# EAGLE design fan_control_module.0.9 (EAGLE 6.4)
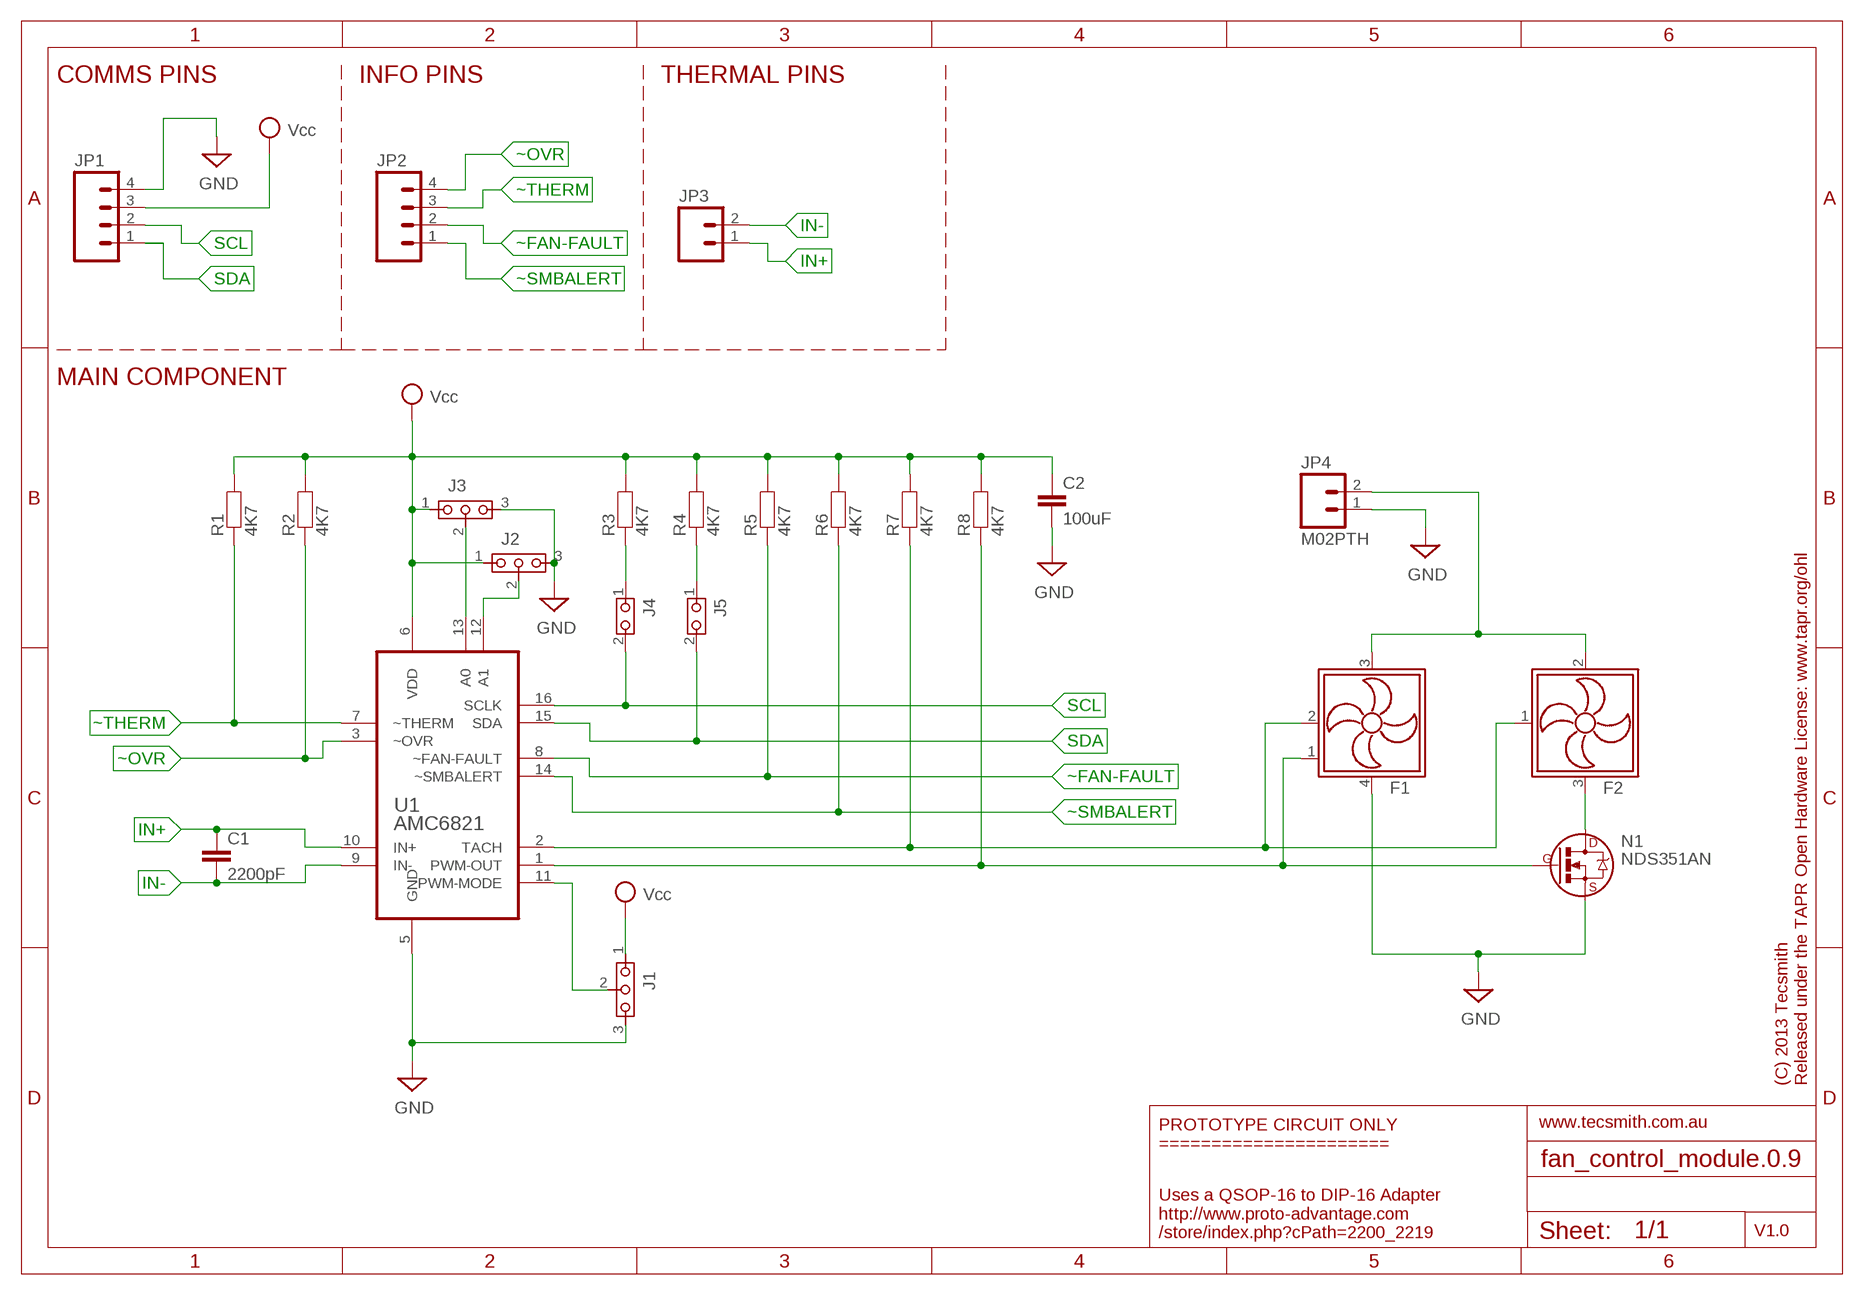
[diagram p0: schematic, sheet 1]

## Parts
C1  2200pF  CAP0603  [0603]
C2  100uF  CAP0603  [0603]
F1  FAN_4-WIREINTEL  [47053-1000]
F2  FAN_3-WIRE  [22-23-2031]
J1  SJ3SMD  [SJ2]
J2  SJ3SMD  [SJ2]
J3  SJ3SMD  [SJ2]
J4  SJSMD  [SJ]
J5  SJSMD  [SJ]
JP1  M04PTH  [1X04]
JP2  M04PTH  [1X04]
JP3  M02PTH  [1X02]
JP4  M02PTH  [1X02]
N1  NDS351AN  NMOSFETGSD  [SOT23]
R1  4K7  RESISTOR0603  [0603]
R2  4K7  RESISTOR0603  [0603]
R3  4K7  RESISTOR0603  [0603]
R4  4K7  RESISTOR0603  [0603]
R5  4K7  RESISTOR0603  [0603]
R6  4K7  RESISTOR0603  [0603]
R7  4K7  RESISTOR0603  [0603]
R8  4K7  RESISTOR0603  [0603]
U1  AMC6821  AMC6821SDBQQSOP  [QSOP-16N]

## Nets
3WIRE-GND: F2.3(GND) N1.3(D)
A0: J3.2 U1.13(A0)
A1: J2.2 U1.12(A1)
GND: C2.2 F1.4(GND) J1.3 J2.3 J3.3 JP1.4 JP4.1 N1.2(S) U1.5(GND)
IN+: C1.1 JP3.1 U1.10(IN+)
IN-: C1.2 JP3.2 U1.9(IN-)
PWM: F1.1(PWM) N1.1(G) R8.1 U1.1(PWM-OUT)
PWM-MODE: J1.2 U1.11(PWM-MODE)
SCL: J4.2 JP1.2 U1.16(SCLK)
SCL-X: J4.1 R3.1
SDA: J5.2 JP1.1 U1.15(SDA)
SDA-X: J5.1 R4.1
TACH: F1.2(SENSE) F2.1(SENSE) R7.1 U1.2(TACH)
VCC: C2.1 J1.1 J2.1 J3.1 JP1.3 R1.2 R2.2 R3.2 R4.2 R5.2 R6.2 R7.2 R8.2 U1.6(VDD) ; supply symbol labelled Vcc
VFAN: F1.3(PWR) F2.2(PWR) JP4.2
~FAN-FAULT: JP2.2 R5.1 U1.8(~FAN-FAULT)
~OVR: JP2.4 R2.1 U1.3(~OVR)
~SMBALERT: JP2.1 R6.1 U1.14(~SMBALERT)
~THERM: JP2.3 R1.1 U1.7(~THERM)

## Notes on the sheet
- COMMS PINS | INFO PINS | THERMAL PINS
- MAIN COMPONENT
- (C) 2013 Tecsmith | Released under the TAPR Open Hardware License: www.tapr.org/ohl
- www.tecsmith.com.au
- PROTOTYPE CIRCUIT ONLY
  ======================
- V1.0
- Uses a QSOP-16 to DIP-16 Adapter
  http://www.proto-advantage.com
  /store/index.php?cPath=2200_2219

## Library data of the parts
C1 C2 = arduino:CAP: Capacitor Standard 0603 ceramic capacitor, and 0.1" leaded capacitor.
F1 = fans:FAN_4-WIRE: INTEL SPEC HEADER Source: http://www.molex.com/pdm_docs/sd/026604100_sd.pdf
F2 = fans:FAN_3-WIRE
J1-J3 = arduino:SJ3
J4 J5 = arduino:SJ: SMD solder JUMPER
JP1 JP2 = arduino:M04: Header 4 Standard 4-pin 0.1" header. Use with straight break away headers (SKU : PRT-00116), right angle break away headers (PRT-00553), swiss pins (PRT-00743), machine pins (PRT-00117), and female headers (PRT-00115). Molex polarized connector foot print use with SKU : PRT-08231 with associated crimp pins and housings.
JP3 JP4 = arduino:M02: Header 2
N1 = arduino:NMOSFET: N-Channel MOSFET
R1-R8 = arduino:RESISTOR: Resistor Basic schematic elements and footprints for 0603, 1206, and PTH 1/10th watt (small) resistors.
U1 = ti-fans:AMC6821SDBQ: Intelligent Temperature Monitor and PWM Fan Controller; MPN: AMC6821SDBQ; OC_FARNELL: 1754744; OC_NEWARK: 52M3024; PACKAGE: QSOP-16; SUPPLIER: TEXAS INSTRUMENTS

## Board
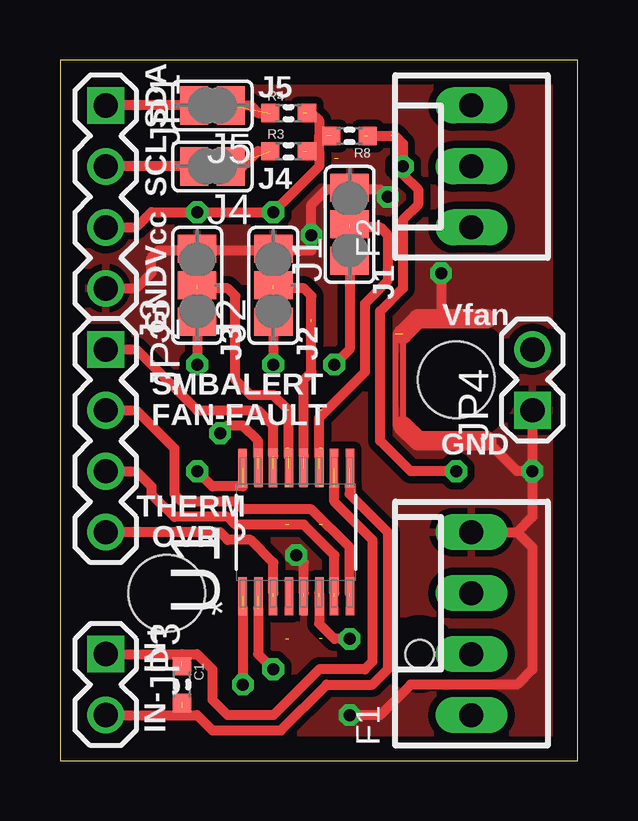
[diagram p1: board, top side]
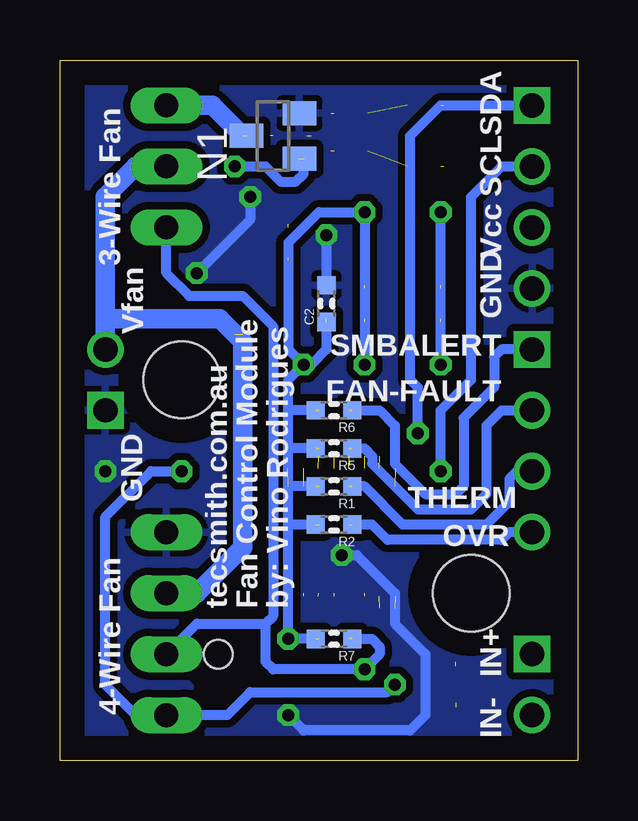
[diagram p2: board, bottom side, seen from below]

Size 21.58 x 29.2 mm. Coordinates in mm from the lower left corner, seen from the top.
Outline: 0,0 21.58,0 21.58,29.2 0,29.2 0,0
Copper layers (1*16): Top 0.035mm / dielectric 1.5mm / Bottom 0.035mm
Design rules "default": minimum track width 10mil, minimum drill 24mil, track to track 8mil, track to pad 8mil, pad to pad 8mil, via to via 8mil, smd to smd 8mil, copper to edge 40mil, drill to drill 8mil, minimum pad ring 10mil, minimum via ring 8mil, stop-mask expansion 4mil, vias tented up to drill 0mil, thermal gap 10mil
Holes 3.2 mm at 16.51,15.88 4.45,6.99

### Footprints (pad centres in the part's own frame; a part is rotated, then mirrored left to right if it is on the bottom)
0603 = smd 0.762 x 0.762: 1 -0.762,0; 2 0.762,0
47053-1000 = drill 1 long: 1 -3.81,0; 2 -1.27,0; 3 1.27,0; 4 3.81,0 | hole 1.2: -1.27,2.159
22-23-2031 = drill 1 long: 1 -2.54,0; 2 0,0; 3 2.54,0
SJ2 = smd 1.168 x 1.6: 1 -1.397,0; 2 0.127,0; 3 1.651,0
SJ = smd 1.168 x 1.6: 1 -0.762,0; 2 0.762,0
1X04 = drill 1.016 square: 1 0,0 | drill 1.016: 2 2.54,0; 3 5.08,0; 4 7.62,0
1X02 = drill 1.016 square: 1 0,0 | drill 1.016: 2 2.54,0
SOT23 = smd 1 x 1.4: 1 -0.95,-1.1; 2 0.95,-1.1; 3 0,1.1
QSOP-16N = smd 1.6 x 0.356: 1 -2.667,2.235; 2 -2.667,1.575; 3 -2.667,0.965; 4 -2.667,0.305; 5 -2.667,-0.305; 6 -2.667,-0.965; 7 -2.667,-1.575; 8 -2.667,-2.235; 9 2.667,-2.235; 10 2.667,-1.575; 11 2.667,-0.965; 12 2.667,-0.305; 13 2.667,0.305; 14 2.667,0.965; 15 2.667,1.575; 16 2.667,2.235

### Placement (x,y rotation side)
C1  5.08,3.17 270 top
C2  10.48,19.05 90 bottom
F1  17.14,5.71 90 top
F2  17.14,24.77 90 top
J1  12.06,22.23 90 top
J2  8.89,19.68 90 top
J3  5.71,19.68 90 top
J4  6.35,24.77 180 top
J5  6.35,27.3 180 top
JP1  1.91,27.3 270 top
JP2  1.91,17.14 270 top
JP3  1.91,4.45 270 top
JP4  19.68,14.61 90 top
N1  12.7,26.04 90 bottom
R1  10.16,11.43 180 bottom
R2  10.16,9.84 180 bottom
R3  9.53,25.4 0 top
R4  9.53,26.99 0 top
R5  10.16,13.02 180 bottom
R6  10.16,14.61 180 bottom
R7  10.16,5.08 180 bottom
R8  12.06,26.04 180 top
U1  9.84,9.53 90 top

### Tracks (layer width: path | path; a pad name or v marks a point on that pad's centre or on a via)
3WIRE-GND  (1 unrouted)
  Bottom 0.813: F2.3 15.24,27.3 13.97,26.04
A0  (2 unrouted)
  Top 0.406: 9.53,12.7 9.53,14.61 8.89,15.24 7.94,15.24 7.3,15.88 7.3,19.37 6.99,19.68 5.71,19.68
A1  (2 unrouted)
  Top 0.406: 10.16,12.7 10.16,15.88 10.48,16.19 10.48,19.37 10.16,19.68 8.89,19.68
GND  (via drill 0.5 pad 0.41)  (2 unrouted)
  Top 0.254: 13.97,17.78 13.97,13.97 | 14.29,17.78 14.29,13.97
  Top 0.406: v9.84,8.57 10.16,8.26 10.16,6.99 | F1.4 19.05,9.53 | 19.05,9.53 19.68,8.89 19.68,3.81 19.05,3.17 14.61,3.17 13.34,1.91 v12.06,1.91 | 19.05,9.53 19.68,10.16 v19.68,12.06 | JP1.4 3.17,19.68 3.81,20.32 3.81,20.95 4.13,21.27 10.48,21.27 10.48,23.18 11.11,23.81 13.34,23.81 v13.65,23.5 | JP4.1 v19.68,12.06 | v15.88,20.32 15.88,18.41 | v19.68,12.06 19.05,12.06 17.78,13.34
  Top 0.813: 14.29,17.78 14.92,18.41 15.88,18.41 17.78,18.41 | 14.29,13.97 14.92,13.34 17.78,13.34
  Bottom 0.406: v9.84,8.57 9.21,8.57 7.62,6.99 7.62,5.71 6.35,4.45 6.35,1.91 6.99,1.27 11.43,1.27 v12.06,1.91 | v10.48,21.91 10.48,19.68 | v13.65,23.5 13.65,22.54 v15.88,20.32
  pour Bottom (isolate 0.305): 0,29.21 0,0 21.59,0 21.59,29.21
  pour Top (isolate 0.305): 0,29.21 0,0 21.59,0 21.59,29.21
IN+  (2 unrouted)
  Top 0.406: 11.43,11.43 11.43,10.79 13.02,9.21 13.02,4.13 12.7,3.81 10.79,3.81 8.89,1.91 6.99,1.91 6.35,2.54 6.35,3.81 5.71,4.45 5.08,4.45 | JP3.1 5.08,4.45 | 5.08,4.45 5.08,4.13
IN-  (2 unrouted)
  Top 0.406: 12.06,11.43 12.06,11.11 13.65,9.53 13.65,3.81 13.02,3.17 11.11,3.17 9.21,1.27 6.35,1.27 5.71,1.91 5.08,1.91 | 5.08,1.91 5.08,2.22 | JP3.2 5.08,1.91
N$1
  Top 0.406: 6.99,27.3 7.94,27.3 8.26,26.99 8.89,26.99
N$5
  Top 0.406: 6.99,24.77 7.62,24.77 8.26,25.4 8.89,25.4
PWM  (via drill 0.5 pad 0.41)  (3 unrouted)
  Top 0.406: 12.7,26.04 13.97,26.04 14.29,25.72 v14.29,24.77 14.29,24.45 14.92,23.81 14.92,23.18 14.29,22.54 14.29,19.68 13.34,18.73 13.34,13.34 14.61,12.06 v16.51,12.06 | 7.62,6.35 v7.62,3.17
  Bottom 0.406: v16.51,12.06 17.78,12.06 19.68,10.16 19.68,3.17 18.41,1.91 F1.1 14.61,1.91 13.65,2.86 7.94,2.86 v7.62,3.17 | 11.43,25.08 11.43,24.45 11.75,24.13 12.38,24.13 13.02,24.77 v14.29,24.77
PWM-MODE  (2 unrouted)
  Top 0.406: 10.79,12.7 10.79,14.29 12.7,16.19 12.7,19.05 13.65,20 13.65,21.91 13.34,22.23 12.06,22.23
SCL  (via drill 0.5)  (2 unrouted)
  Top 0.406: 5.71,24.77 JP1.2 | 7.62,11.43 6.35,11.43 v5.71,12.06
  Bottom 0.406: v5.71,12.06 5.71,14.61 4.45,15.88 4.45,23.5 3.17,24.77 JP1.2
SCL-X  (1 unrouted)
SDA  (via drill 0.5)  (2 unrouted)
  Top 0.406: 5.71,27.3 JP1.1 | 8.26,12.7 8.26,13.34 7.62,13.97 6.99,13.97 v6.67,13.65
  Bottom 0.406: v6.67,13.65 6.67,15.56 6.99,15.88 6.99,26.04 5.71,27.3 JP1.1
SDA-X  (1 unrouted)
TACH  (via drill 0.5 pad 0.41)  (2 unrouted)
  Top 0.406: 8.26,6.35 8.26,4.45 v8.89,3.81
  Bottom 0.406: F2.1 17.14,20.32 16.19,19.37 13.97,19.37 12.7,18.1 12.7,6.03 13.02,5.71 | 13.02,5.71 13.02,4.13 12.7,3.81 v8.89,3.81 8.26,4.45 8.26,4.76 8.57,5.08 9.53,5.08 | F1.2 15.88,5.71 13.02,5.71
VCC  (via drill 0.5, 0.5 pad 0.41)  (13 unrouted)
  Top 0.406: 8.89,18.41 v8.89,16.51 | 10.79,6.99 10.79,5.71 11.43,5.08 v12.06,5.08 | JP1.3 3.17,22.23 3.81,22.86 v5.71,22.86 v8.89,22.86 10.79,24.77 10.79,25.4 | 5.71,18.41 v5.71,16.51 | 10.16,26.99 10.48,26.99 10.79,26.67 10.79,26.04 | 10.16,25.4 10.79,25.4 | 10.79,25.4 10.79,26.04 | 12.06,20.95 12.06,17.14 v11.43,16.51 | 11.11,26.04 10.79,26.04
  Bottom 0.406: 10.79,5.08 v12.06,5.08 12.06,9.84 | v5.71,16.51 v5.71,22.86 | v8.89,16.51 v8.89,22.86 10.79,22.86 12.06,21.59 12.06,17.14 v11.43,16.51 | 12.06,9.84 12.06,11.43 | 12.06,11.43 12.06,13.02 | 12.06,13.02 12.06,14.61 | 12.06,14.61 12.06,15.88 v11.43,16.51 | 10.79,14.61 12.06,14.61 | 10.79,13.02 12.06,13.02 | 10.79,11.43 12.06,11.43 | 10.79,9.84 12.06,9.84 | 10.48,18.41 10.48,17.14 11.11,16.51 v11.43,16.51
VFAN
  Bottom 0.813: F1.3 15.88,6.99 13.97,8.89 13.97,17.46 14.92,18.41 19.68,18.41 | JP4.2 19.68,18.41 | 19.68,18.41 19.68,23.5 18.41,24.77 F2.2
~FAN-FAULT  (2 unrouted)
  Top 0.406: 12.06,6.99 12.06,8.89 10.48,10.48 7.62,10.48 7.3,10.79 5.08,10.79 4.76,11.11 4.76,13.02 3.17,14.61 JP2.2
  Bottom 0.406: JP2.2 3.17,14.61 3.81,13.97 3.81,11.11 4.45,10.48 6.67,10.48 8.57,12.38 8.57,12.7 8.89,13.02 9.53,13.02
~OVR  (2 unrouted)
  Top 0.406: 8.89,6.99 8.89,8.26 7.94,9.21 6.99,9.21 6.67,9.53 JP2.4
  Bottom 0.406: JP2.4 2.86,9.53 3.17,9.21 7.94,9.21 8.57,9.84 9.53,9.84
~SMBALERT  (2 unrouted)
  Top 0.406: 8.89,12.7 8.89,13.97 8.26,14.61 5.71,14.61 3.17,17.14 JP2.1
  Bottom 0.406: JP2.1 3.17,17.14 3.49,16.83 3.49,15.56 4.76,14.29 4.76,11.43 5.08,11.11 6.35,11.11 7.62,12.38 7.62,13.97 8.26,14.61 9.53,14.61
~THERM  (2 unrouted)
  Top 0.406: 11.43,6.99 11.43,8.57 10.16,9.84 7.3,9.84 6.99,10.16 4.76,10.16 3.81,11.11 3.81,11.43 3.17,12.06 JP2.3
  Bottom 0.406: JP2.3 2.54,12.06 2.86,11.75 2.86,10.79 3.81,9.84 7.3,9.84 8.89,11.43 9.53,11.43

### Text on the board
tPlace: J5 | SDA | J4 | SCL | Vcc | J1 | Vfan | GND | J3 | J2 | SMBALERT | FAN-FAULT | GND | THERM | OVR | IN+ | IN-
bPlace: SDA | SCL | Vcc | 3-Wire Fan | GND | SMBALERT | Vfan | FAN-FAULT | GND | THERM | OVR | by: Vino Rodrigues | Fan Control Module | tecsmith.com.au | IN+ | 4-Wire Fan | IN-